# EAGLE schematic ramanSpectrometer_imagingBoard_CCD (EAGLE 6.2)
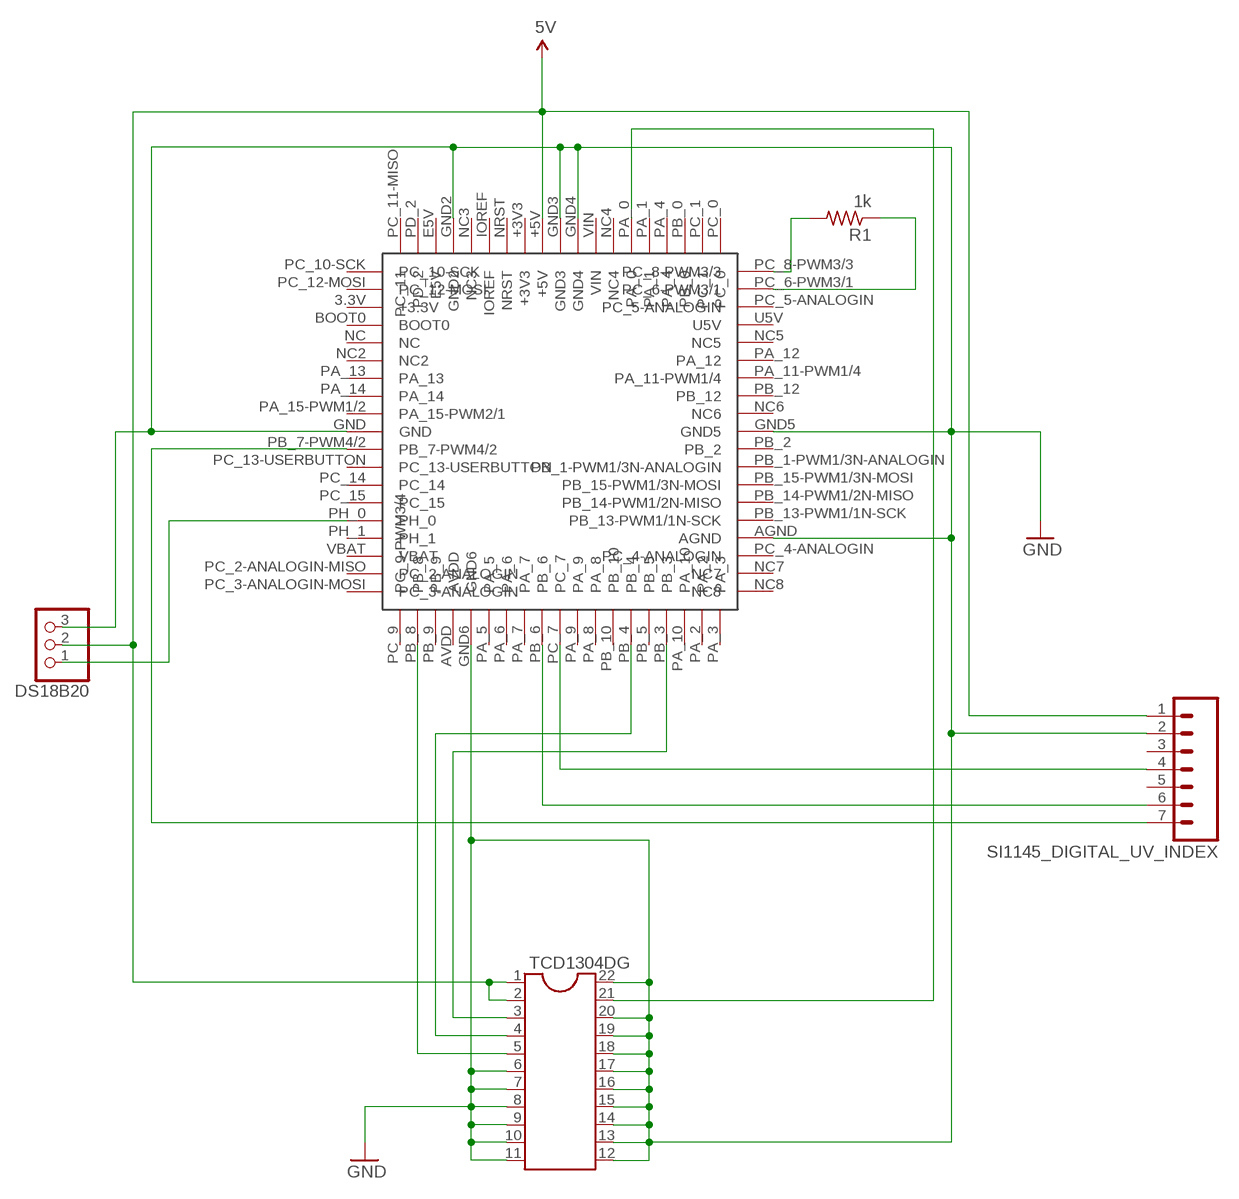
[diagram p0: schematic, sheet 1]

## Parts
DS18B20  PINHD-1X3  [1X03]
R1  1k  R-US_M1206  [M1206]
SI1145_DIGITAL_UV_INDEX  M07LOCK  [1X07_LOCK]
TCD1304DG  DIL22-4  [DIL22-4]
U$1  STNUCLEOF401RE  [F401-RE]

## Nets
5V: DS18B20.2 SI1145_DIGITAL_UV_INDEX.1 TCD1304DG.1 TCD1304DG.2 U$1.+5V
GND: DS18B20.3 SI1145_DIGITAL_UV_INDEX.2 TCD1304DG.6 TCD1304DG.7 TCD1304DG.8 TCD1304DG.9 TCD1304DG.10 TCD1304DG.11 TCD1304DG.12 TCD1304DG.13 TCD1304DG.14 TCD1304DG.15 TCD1304DG.16 TCD1304DG.17 TCD1304DG.18 TCD1304DG.19 TCD1304DG.20 TCD1304DG.22 U$1.AGND U$1.GND U$1.GND2 U$1.GND3 U$1.GND4 U$1.GND5 U$1.GND6
N$1: TCD1304DG.5 U$1.PB_8
N$2: TCD1304DG.4 U$1.PB_4
N$3: TCD1304DG.3 U$1.PB_3
N$4: R1.2 U$1.PC_8-PWM3/3
N$5: R1.1 U$1.PC_6-PWM3/1
N$6: DS18B20.1 U$1.PH_0
N$7: SI1145_DIGITAL_UV_INDEX.7 U$1.PB_7-PWM4/2
N$8: SI1145_DIGITAL_UV_INDEX.6 U$1.PB_6
N$9: TCD1304DG.21 U$1.PA_0
N$10: SI1145_DIGITAL_UV_INDEX.4 U$1.PC_7
Unconnected: SI1145_DIGITAL_UV_INDEX.3 SI1145_DIGITAL_UV_INDEX.5 U$1.+3V3 U$1.BOOT0 U$1.IOREF U$1.NC U$1.NC2 U$1.NC3 U$1.NC4 U$1.NC5 U$1.NC7 U$1.NC8 U$1.NRST U$1.PA_1 U$1.PA_2 U$1.PA_3 U$1.PA_4 U$1.PA_5 U$1.PA_6 U$1.PA_7 U$1.PA_8 U$1.PA_9 U$1.PA_10 U$1.PA_11-PWM1/4 U$1.PA_12 U$1.PA_13 U$1.PA_14 U$1.PA_15-PWM1/2(PA_15-PWM2/1) U$1.PB_0 U$1.PB_1-PWM1/3N-ANALOGIN U$1.PB_2 U$1.PB_5 U$1.PB_9 U$1.PB_10 U$1.PB_12 U$1.PB_13-PWM1/1N-SCK U$1.PB_14-PWM1/2N-MISO U$1.PB_15-PWM1/3N-MOSI U$1.PC_0 U$1.PC_1 U$1.PC_2-ANALOGIN-MISO(PC_2-ANALOGIN) U$1.PC_3-ANALOGIN-MOSI(PC_3-ANALOGIN) U$1.PC_4-ANALOGIN U$1.PC_5-ANALOGIN U$1.PC_9(PC_9-PWM3/4) U$1.PC_10-SCK U$1.PC_11-MISO(PC_11) U$1.PC_12-MOSI U$1.PC_13-USERBUTTON U$1.PC_14 U$1.PC_15 U$1.PD_2 U$1.PH_1 U$1.U5V U$1.VIN

## Power pins joined to a net without a drawn wire
+3.3V: U$1.3.3V(+3.3V)
AVDD: U$1.AVDD
E5V: U$1.E5V
NC6: U$1.NC6
VBAT: U$1.VBAT

## Library data of the parts
DS18B20 = adafruit:PINHD-1X3: PIN HEADER
R1 = adafruit:R-US_: RESISTOR, American symbol
SI1145_DIGITAL_UV_INDEX = SparkFun-Connectors:M07: Header 7 Standard 7-pin 0.1" header. Use with straight break away headers (SKU : PRT-00116), right angle break away headers (PRT-00553), swiss pins (PRT-00743), machine pins (PRT-00117), and female headers (PRT-00115). NOTES ON THE VARIANTS LOCK and LOCK_LONGPADS... This footprint was designed to help hold the alignment of a through-hole component (i.e. 7-pin header) while soldering it into place. You may notice that each hole has been shifted either up or down by 0.005 of an inch from it's more standard position (which is usually a perfectly straight line). This slight alteration caused the pins (the squares in the middle) to touch the edges of the holes. Because they are alternating, it causes a "brace" to hold the header in place. 0.005 has proven to be the perfect amount of "off-center" position when using our standard breakaway headers. Although looks a little odd when you look at the bare footprint, once you have a header in there, the alteration is very hard to notice. Also, if you push a header all the way into place, it is covered up entirely on the bottom side. This idea of altering the position of holes to aid alignment will be further integrated into the Sparkfun Library for other footprints. It can help hold any component with 3 or more connection pins.
TCD1304DG = ic-package:DIL22: Dual In Line / Socket
U$1 = nucleoF401RE:STNUCLEOF401RE